# Altium schematic sheet Core.SchDoc
size A4; SheetNumber: 1; SheetTotal: 7
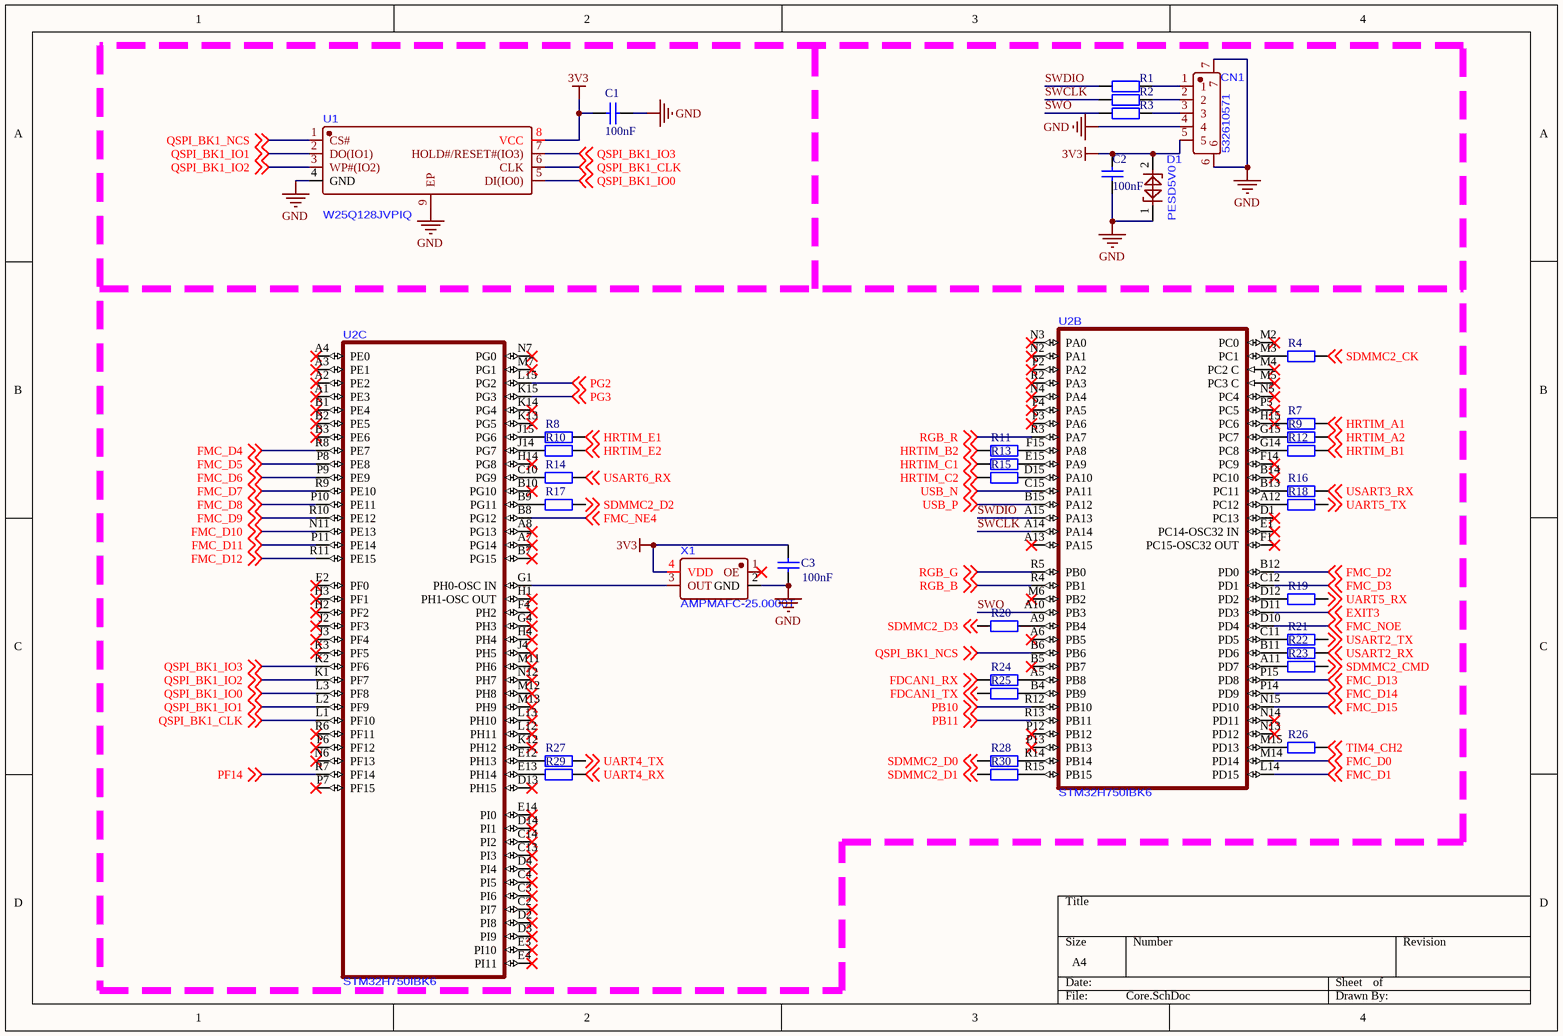
[diagram p0: Core.SchDoc]

## Parts
C1  100nF  [0402_C]
C2  100nF  [0402_C]
C3  100nF  [0402_C]
CN1  532610571  [CONN-SMD_5P-P1.25_532610571-2]
D1  PESD5V0  [SOD-882_L1.0-W0.6-BI]
R1  100Ω  [0402_R]  (value not drawn)
R2  100Ω  [0402_R]  (value not drawn)
R3  100Ω  [0402_R]  (value not drawn)
R4  10Ω  [0402_R]  (value not drawn)
R7  10Ω  [0402_R]  (value not drawn)
R8  10Ω  [0402_R]  (value not drawn)
R9  10Ω  [0402_R]  (value not drawn)
R10  10Ω  [0402_R]  (value not drawn)
R11  10Ω  [0402_R]  (value not drawn)
R12  10Ω  [0402_R]  (value not drawn)
R13  10Ω  [0402_R]  (value not drawn)
R14  10Ω  [0402_R]  (value not drawn)
R15  10Ω  [0402_R]  (value not drawn)
R16  10Ω  [0402_R]  (value not drawn)
R17  10Ω  [0402_R]  (value not drawn)
R18  10Ω  [0402_R]  (value not drawn)
R19  10Ω  [0402_R]  (value not drawn)
R20  10Ω  [0402_R]  (value not drawn)
R21  10Ω  [0402_R]  (value not drawn)
R22  10Ω  [0402_R]  (value not drawn)
R23  10Ω  [0402_R]  (value not drawn)
R24  10Ω  [0402_R]  (value not drawn)
R25  10Ω  [0402_R]  (value not drawn)
R26  10Ω  [0402_R]  (value not drawn)
R27  10Ω  [0402_R]  (value not drawn)
R28  10Ω  [0402_R]  (value not drawn)
R29  10Ω  [0402_R]  (value not drawn)
R30  10Ω  [0402_R]  (value not drawn)
U1  W25Q128JVPIQ  [WSON-8]
U2  STM32H750IBK6  [UFBGA176+25]  (parts B,C of 3)
X1  AMPMAFC-25.0000T  [OSC-SMD_4P-L2.0-W1.6-BL_ABRACON_AMPMAXXX]

## Nets
3V3: C1.2 C2.2 C3.2 CN1.5 D1.2 U1.8(VCC) X1.4(VDD)
GND: C1.1 C2.1 C3.1 CN1.4 CN1.6 CN1.7 D1.1 U1.4(GND) U1.9(EP) X1.2(GND)
EXIT3: U2.D11(PD3) ; off-sheet EXIT3
FDCAN1_RX: R24.1 ; off-sheet FDCAN1_RX
FDCAN1_TX: R25.1 ; off-sheet FDCAN1_TX
FMC_D0: U2.M14(PD14) ; off-sheet FMC_D0
FMC_D1: U2.L14(PD15) ; off-sheet FMC_D1
FMC_D2: U2.B12(PD0) ; off-sheet FMC_D2
FMC_D3: U2.C12(PD1) ; off-sheet FMC_D3
FMC_D4: U2.R8(PE7) ; off-sheet FMC_D4
FMC_D5: U2.P8(PE8) ; off-sheet FMC_D5
FMC_D6: U2.P9(PE9) ; off-sheet FMC_D6
FMC_D7: U2.R9(PE10) ; off-sheet FMC_D7
FMC_D8: U2.P10(PE11) ; off-sheet FMC_D8
FMC_D9: U2.R10(PE12) ; off-sheet FMC_D9
FMC_D10: U2.N11(PE13) ; off-sheet FMC_D10
FMC_D11: U2.P11(PE14) ; off-sheet FMC_D11
FMC_D12: U2.R11(PE15) ; off-sheet FMC_D12
FMC_D13: U2.P15(PD8) ; off-sheet FMC_D13
FMC_D14: U2.P14(PD9) ; off-sheet FMC_D14
FMC_D15: U2.N15(PD10) ; off-sheet FMC_D15
FMC_NE4: U2.B8(PG12) ; off-sheet FMC_NE4
FMC_NOE: U2.D10(PD4) ; off-sheet FMC_NOE
HRTIM_A1: R7.2 ; off-sheet HRTIM_A1
HRTIM_A2: R9.2 ; off-sheet HRTIM_A2
HRTIM_B1: R12.2 ; off-sheet HRTIM_B1
HRTIM_B2: R11.1 ; off-sheet HRTIM_B2
HRTIM_C1: R13.1 ; off-sheet HRTIM_C1
HRTIM_C2: R15.1 ; off-sheet HRTIM_C2
HRTIM_E1: R8.2 ; off-sheet HRTIM_E1
HRTIM_E2: R10.2 ; off-sheet HRTIM_E2
PB10: U2.R12(PB10) ; off-sheet PB10
PB11: U2.R13(PB11) ; off-sheet PB11
PF14: U2.R7(PF14) ; off-sheet PF14
PG2: U2.L15(PG2) ; off-sheet PG2
PG3: U2.K15(PG3) ; off-sheet PG3
QSPI_BK1_CLK: U1.6(CLK) U2.L1(PF10) ; off-sheet QSPI_BK1_CLK
QSPI_BK1_IO0: U1.5(DI(IO0)) U2.L3(PF8) ; off-sheet QSPI_BK1_IO0
QSPI_BK1_IO1: U1.2(DO(IO1)) U2.L2(PF9) ; off-sheet QSPI_BK1_IO1
QSPI_BK1_IO2: U1.3(WP#(IO2)) U2.K1(PF7) ; off-sheet QSPI_BK1_IO2
QSPI_BK1_IO3: U1.7(HOLD#/RESET#(IO3)) U2.K2(PF6) ; off-sheet QSPI_BK1_IO3
QSPI_BK1_NCS: U1.1(CS#) U2.B6(PB6) ; off-sheet QSPI_BK1_NCS
RGB_B: U2.R4(PB1) ; off-sheet RGB_B
RGB_G: U2.R5(PB0) ; off-sheet RGB_G
RGB_R: U2.R3(PA7) ; off-sheet RGB_R
SDMMC2_CK: R4.2 ; off-sheet SDMMC2_CK
SDMMC2_CMD: R23.2 ; off-sheet SDMMC2_CMD
SDMMC2_D0: R28.1 ; off-sheet SDMMC2_D0
SDMMC2_D1: R30.1 ; off-sheet SDMMC2_D1
SDMMC2_D2: R17.2 ; off-sheet SDMMC2_D2
SDMMC2_D3: R20.1 ; off-sheet SDMMC2_D3
SWCLK: R2.1 U2.A14(PA14)
SWDIO: R1.1 U2.A15(PA13)
SWO: R3.1 U2.A10(PB3)
TIM4_CH2: R26.2 ; off-sheet TIM4_CH2
UART4_RX: R29.1 ; off-sheet UART4_RX
UART4_TX: R27.1 ; off-sheet UART4_TX
UART5_RX: R19.1 ; off-sheet UART5_RX
UART5_TX: R18.1 ; off-sheet UART5_TX
USART2_RX: R22.2 ; off-sheet USART2_RX
USART2_TX: R21.2 ; off-sheet USART2_TX
USART3_RX: R16.2 ; off-sheet USART3_RX
USART6_RX: R14.2 ; off-sheet USART6_RX
USB_N: U2.C15(PA11) ; off-sheet USB_N
USB_P: U2.B15(PA12) ; off-sheet USB_P
NetCN1_1: CN1.1 R1.2
NetCN1_2: CN1.2 R2.2
NetCN1_3: CN1.3 R3.2
NetR4_1: R4.1 U2.M3(PC1)
NetR7_1: R7.1 U2.H15(PC6)
NetR8_1: R8.1 U2.J15(PG6)
NetR9_1: R9.1 U2.G15(PC7)
NetR10_1: R10.1 U2.J14(PG7)
NetR11_2: R11.2 U2.F15(PA8)
NetR12_1: R12.1 U2.G14(PC8)
NetR13_2: R13.2 U2.E15(PA9)
NetR14_1: R14.1 U2.C10(PG9)
NetR15_2: R15.2 U2.D15(PA10)
NetR16_1: R16.1 U2.B13(PC11)
NetR17_1: R17.1 U2.B9(PG11)
NetR18_2: R18.2 U2.A12(PC12)
NetR19_2: R19.2 U2.D12(PD2)
NetR20_2: R20.2 U2.A9(PB4)
NetR21_1: R21.1 U2.C11(PD5)
NetR22_1: R22.1 U2.B11(PD6)
NetR23_1: R23.1 U2.A11(PD7)
NetR24_2: R24.2 U2.A5(PB8)
NetR25_2: R25.2 U2.B4(PB9)
NetR26_1: R26.1 U2.M15(PD13)
NetR27_2: R27.2 U2.E12(PH13)
NetR28_2: R28.2 U2.R14(PB14)
NetR29_2: R29.2 U2.E13(PH14)
NetR30_2: R30.2 U2.R15(PB15)
NetU2_G1: U2.G1(PH0-OSC_IN) X1.3(OUT)

Not connected (* = marked no-connect by the designer): U2 A1(PE3)* A2(PE2)* A3(PE1)* A4(PE0)* A6(PB5)* A7(PG14)* A8(PG13)* A13(PA15)* B1(PE4)* B2(PE5)* B3(PE6)* B5(PB7)* B7(PG15)* B10(PG10)* B14(PC10)* C2(PI7)* C3(PI6)* C4(PI5)* C13(PI3)* C14(PI2)* D1(PC13)* D2(PI8)* D3(PI9)* D4(PI4)* D13(PH15)* D14(PI1)* E1(PC14-OSC32_IN)* E2(PF0)* E3(PI10)* E4(PI11)* E14(PI0)* F1(PC15-OSC32_OUT)* F4(PH2)* F14(PC9)* G4(PH3)* H1(PH1-OSC_OUT)* H2(PF2)* H3(PF1)* H4(PH4)* H14(PG8)* J2(PF3)* J3(PF4)* J4(PH5)* K3(PF5)* K12(PH12)* K13(PG5)* K14(PG4)* L12(PH11)* L13(PH10)* M2(PC0)* M4(PC2_C)* M5(PC3_C)* M6(PB2)* M7(PG1)* M11(PH6)* M12(PH8)* M13(PH9)* N2(PA1)* N3(PA0)* N4(PA4)* N5(PC4)* N6(PF13)* N7(PG0)* N12(PH7)* N13(PD12)* N14(PD11)* P2(PA2)* P3(PA6)* P4(PA5)* P5(PC5)* P6(PF12)* P7(PF15)* P12(PB12)* P13(PB13)* R2(PA3)* R6(PF11)*; X1 1(OE)*

## Library data of the parts
C1-C3 = 0402 100nF (104) 10% 16V: 贴片电容; ComponentLink1Description: 供应商链接; ComponentLink1URL: http://www.szlcsc.com/product/details_1877.html; Package: 0402; Supplier: LC; SuppliersPartNumber: C1525
D1 = PESD5V0F1BL,315
R1-R3 = 0402 10KΩ (1002) 1%: 贴片电阻; ComponentLink1Description: 供应商链接; ComponentLink1URL: http://www.szlcsc.com/product/details_26487.html; Package: 0402; Supplier: LC; SuppliersPartNumber: C25744
R4 R7-R30 = 0402 10Ω (10R0) 1%: 贴片电阻; ComponentLink1Description: 供应商链接; ComponentLink1URL: http://www.szlcsc.com/product/details_25820.html; Package: 0402; Supplier: LC; SuppliersPartNumber: C25077